# EAGLE design Min_Core_Display_v2 (EAGLE 9.3.0)
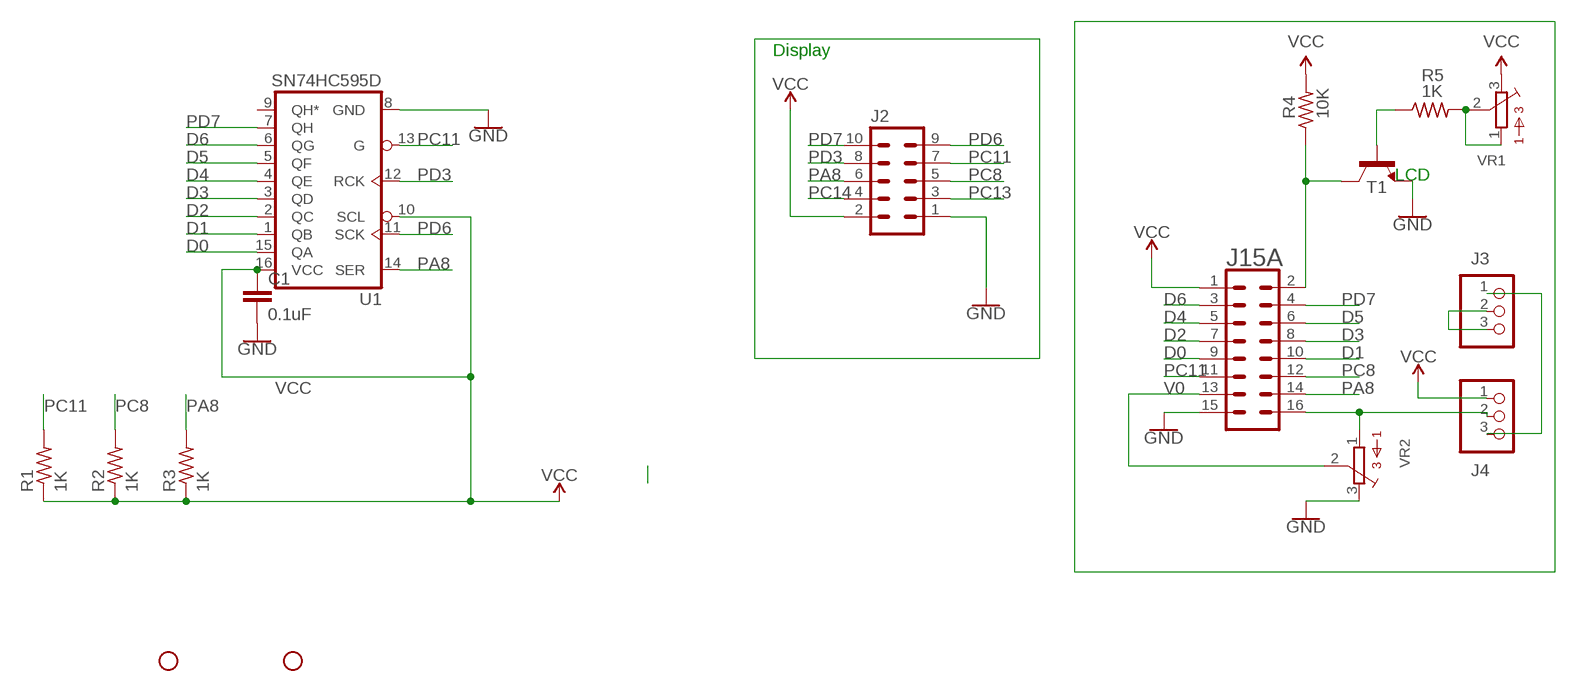
[diagram p0: schematic, sheet 1]

## Parts
C1  0.1uF  0.1UF-0603-25V-(+80/-20%)  [0603]
H2  STAND-OFFTIGHT  [STAND-OFF-TIGHT]
H4  STAND-OFFTIGHT  [STAND-OFF-TIGHT]
J2  10PIN_BACKSIDE  [10PIN_BACKSIDE]
J3  PINHD-1X3  [1X03]
J4  PINHD-1X3  [1X03]
J15A  CONN_08X2_SHROUD  [2X8-SHROUDED_LOCK]
R1  1K  R-US_R0603  [R0603]
R2  1K  R-US_R0603  [R0603]
R3  1K  R-US_R0603  [R0603]
R4  10K  R-US_R0603  [R0603]
R5  1K  R-US_R0603  [R0603]
T1  600mA/40V  TRANS_NPN-P2N2222A  [TO-92]
U1  SN74HC595D  74HC595D  [SO16]
VR1  BOURNS_3362P_TRIMMERP  [BOURNS_3362P_TRIMMER]
VR2  BOURNS_3362P_TRIMMERP  [BOURNS_3362P_TRIMMER]

## Nets
D0: J15A.9 U1.15(QA)
D1: J15A.10 U1.1(QB)
D2: J15A.7 U1.2(QC)
D3: J15A.8 U1.3(QD)
D4: J15A.5 U1.4(QE)
D5: J15A.6 U1.5(QF)
D6: J15A.3 U1.6(QG)
GND: C1.2 J2.1 J15A.15 T1.3(E) U1.8(GND) VR2.3
N$2: R5.1 T1.2(B)
N$3: J3.2 J3.3
N$5: R5.2 VR1.1 VR1.2
N$7: J15A.2 R4.1 T1.1(C)
N$9: J3.1 J4.3
N$10: J4.2 J15A.16 VR2.1
PA8: J2.6 J15A.14 R3.2 U1.14(SER)
PC8: J2.5 J15A.12 R2.2
PC11: J2.7 J15A.11 R1.2 U1.13(G)
PC13: J2.3
PC14: J2.4
PD3: J2.8 U1.12(RCK)
PD6: J2.9 U1.11(SCK)
PD7: J2.10 J15A.4 U1.7(QH)
V0: J15A.13 VR2.2
VCC: C1.1 J2.2 J4.1 J15A.1 R1.1 R2.1 R3.1 R4.2 U1.10(SCL) U1.16(VCC) VR1.3
Unconnected: U1.9(QH*)

## Notes on the sheet
- Display
- LCD

## Library data of the parts
C1 = SparkFun-Capacitors:0.1UF: 0.1µF ceramic capacitors A capacitor is a passive two-terminal electrical component used to store electrical energy temporarily in an electric field.; PROD_ID: CAP-00810
H2 H4 = SparkFun-Hardware:STAND-OFF: Stand Off Drill holes for mechanically mounting via screws, standoffs, etc. Note: Use the keepout ring to avoid running the screw head into surrounding components. Variant Overviews STAND-OFF - Mechanical footprint for a #4 phillips button head screw. STAND-OFF-TIGHT - Mechanical footprint for a #4 phillips button head screw, Example SparkFun Products Screw - Phillips Head (1/4", 4-40, 10 pack) <https://www.sparkfun.com/products/10453> (PRT-10453) Screw - Phillips Head (1/2", 4-40, 10 pack) <https://www.sparkfun.com/products/10452> (PRT-10452) Screw - Phillips Head (3/4", 4-40, 10 pack) <https://www.sparkfun.com/products/10451> (PRT-10451) Screw - Phillips Head (1", 4-40, 10 pack) <https://www.sparkfun.com/products/10450> (PRT-10450)
J2 = MusicThingModular:10PIN_BACKSIDE: PIN HEADER; OC_FARNELL: unknown; OC_NEWARK: unknown
J3 J4 = adafruit:PINHD-1X3: PIN HEADER
J15A = SparkFun-Connectors:CONN_08X2: Multi connection point. Often used as Generic Header-pin footprint for 0.1 inch spaced/style header connections You can populate with any combo of single row headers, but if you'd like an exact match, check this: Header - 2x8 (Male, 0.1") <https://www.sparkfun.com/products/13156> (PRT-13156) On any of the 0.1 inch spaced packages, you can populate with these: Break Away Headers - Straight <https://www.sparkfun.com/products/116> (PRT-00116) Break Away Male Headers - Right Angle <https://www.sparkfun.com/products/553> (PRT-00553) Female Headers <https://www.sparkfun.com/products/115> (PRT-00115) Break Away Headers - Machine Pin <https://www.sparkfun.com/products/117> (PRT-00117) Break Away Female Headers - Swiss Machine Pin <https://www.sparkfun.com/products/743> (PRT-00743)
R1-R5 = adafruit:R-US_: RESISTOR, American symbol
T1 = SparkFun-DiscreteSemi:TRANS_NPN: NPN transistor Current controlled devices typically used to amplify current or used as a switch. BC547 - COM-08928 <http://www.sparkfun.com/products/8928> (TO-92 45V 100mA) (1.Collector 2.Base 3.Emitter) 2N3904 - COM-00521 <http://www.sparkfun.com/products/521> (TO-92 40V 200mA) (1.Emitter 2.Base 3.Collector) P2N2222A - COM-12852 <http://www.sparkfun.com/products/12852> (TO-92 40V 600mA) (1.Collector 2.Base 3.Emitter); PROD_ID: TRANS-09536
U1 = SparkFun-IC-Logic:74*595: 8-Bit Shift Register (Serial to Parallel) Datasheet <http://cdn.sparkfun.com/datasheets/BreakoutBoards/MM74HC595.pdf> SparkFun Products SparkFun Shift Register Breakout - 74HC595 <https://www.sparkfun.com/products/10680> (BOB-10680); PROD_ID: IC-07875
VR1 VR2 = MusicThingModular:BOURNS_3362P_TRIMMER: 3362 Series 1/4" Square Trimmer

## Net classes
0 default: width 0.508 mm, drill 1.016 mm, clearance 0.508 mm

## Board
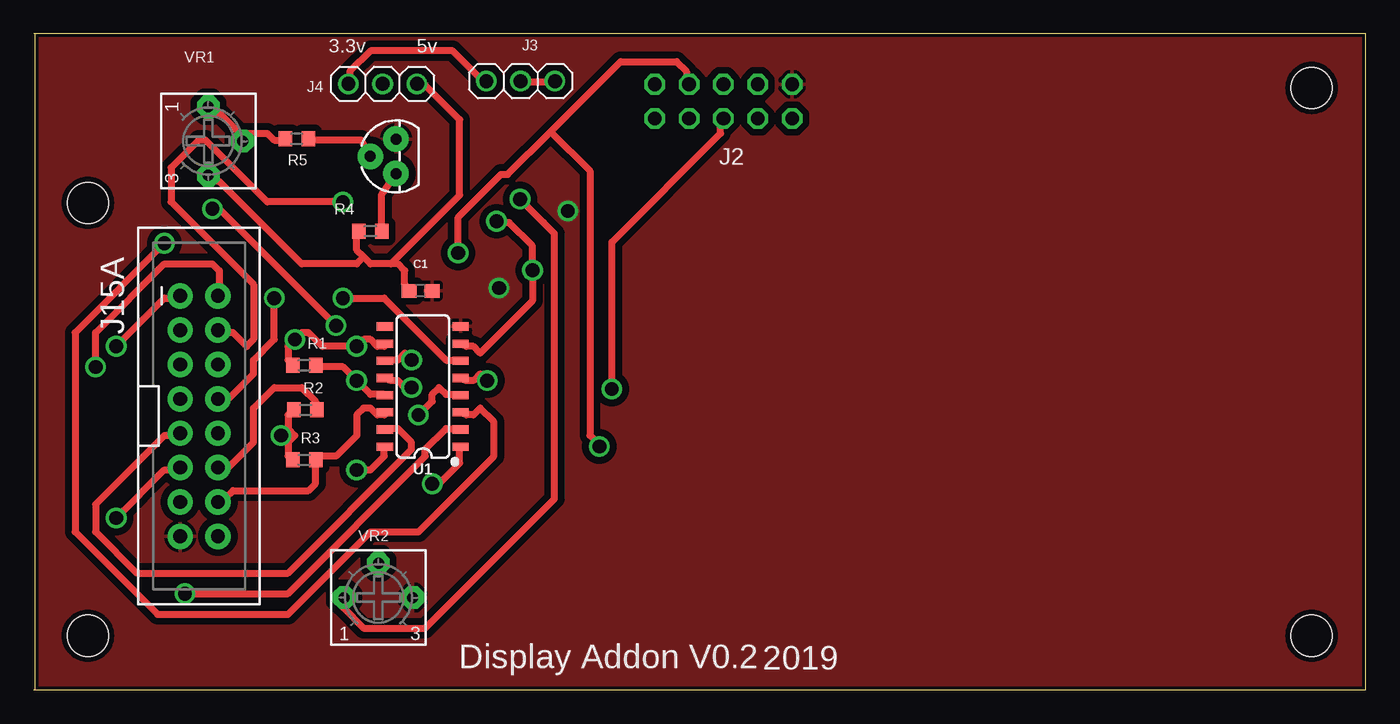
[diagram p1: board, top side]
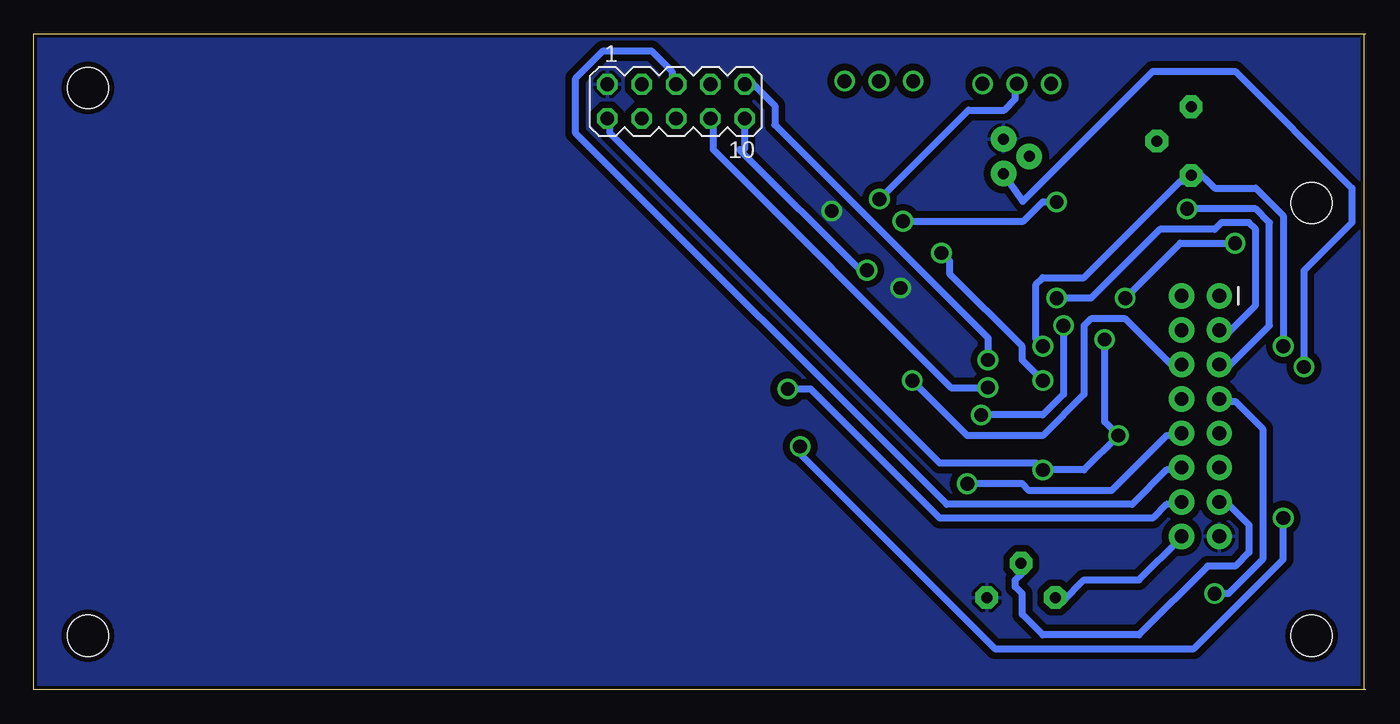
[diagram p2: board, bottom side, seen from below]

Size 98.5 x 48.5 mm. Coordinates in mm from the lower left corner, seen from the top.
Outline: 0,0 0.1,0
Outline: 0.1,0 98.5,0 98.5,48.5 0.1,48.5
Outline: 0.1,48.5 0,48.5
Outline: 0.1,0 0.1,48.5
Copper layers (1*16): Top 0.035mm / dielectric 1.5mm / Bottom 0.035mm
Design rules "dirt_cheap_dirty_boards.v1.1": minimum track width 6mil, minimum drill 12mil, track to track 6mil, track to pad 6mil, pad to pad 6mil, via to via 6mil, smd to smd 0mil, copper to edge 10mil, drill to drill 10mil, minimum pad ring 10mil, minimum via ring 6mil, stop-mask expansion 2mil, vias tented up to drill 25mil, thermal gap 10mil

### Footprints (pad centres in the part's own frame; a part is rotated, then mirrored left to right if it is on the bottom)
0603 = smd 1.1 x 1: 1 -0.85,0; 2 0.85,0
STAND-OFF-TIGHT = hole 3.048: 0,0
10PIN_BACKSIDE = drill 1.016 octagon: 1 -5.08,-1.27; 2 -5.08,1.27; 3 -2.54,-1.27; 4 -2.54,1.27; 5 0,-1.27; 6 0,1.27; 7 2.54,-1.27; 8 2.54,1.27; 9 5.08,-1.27; 10 5.08,1.27
1X03 = drill 1.016: 1 -2.54,0; 2 0,0; 3 2.54,0
2X8-SHROUDED_LOCK = drill 1.016 pad 1.88: 1 -1.397,8.89; 2 1.397,8.89; 3 -1.397,6.35; 4 1.397,6.35; 5 -1.397,3.81; 6 1.397,3.81; 7 -1.397,1.27; 8 1.397,1.27; 9 -1.397,-1.27; 10 1.397,-1.27; 11 -1.397,-3.81; 12 1.397,-3.81; 13 -1.397,-6.35; 14 1.397,-6.35; 15 -1.397,-8.89; 16 1.397,-8.89
R0603 = smd 1 x 1.1: 1 -0.85,0; 2 0.85,0
TO-92 = drill 0.813 pad 1.88: 1 -1.27,0; 2 0,1.905; 3 1.27,0
SO16 = smd 0.6 x 1.2: 1 -4.445,-2.8; 2 -3.175,-2.8; 3 -1.905,-2.8; 4 -0.635,-2.8; 5 0.635,-2.8; 6 1.905,-2.8; 7 3.175,-2.8; 8 4.445,-2.8; 9 4.445,2.8; 10 3.175,2.8; 11 1.905,2.8; 12 0.635,2.8; 13 -0.635,2.8; 14 -1.905,2.8; 15 -3.175,2.8; 16 -4.445,2.8
BOURNS_3362P_TRIMMER = drill 0.813 pad 1.676 octagon: 1 -2.54,0; 2 0,2.54; 3 2.54,0

### Placement (x,y rotation side)
C1  28.6,29.5 0 top
H1  STAND-OFFTIGHT  [STAND-OFF-TIGHT]  94.5,4 0 top
H2  4,36 0 top
H3  STAND-OFFTIGHT  [STAND-OFF-TIGHT]  94.5,44.5 90 top
H4  4,4 0 top
J2  51,43.5 180 top
J3  36,45 0 top
J4  25.8,44.8 180 top
J15A  12.22,20.24 0 top
R1  20,24 0 top
R2  20.1,20.7 0 top
R3  20,17 0 top
R4  24.89,33.91 180 top
R5  19.44,40.74 180 top
T1  26.79,39.44 90 top
U1  28.76,22.42 90 top
VR1  12.91,40.57 270 top
VR2  25.49,6.82 0 top

### Tracks (layer width: path | path; a pad name or v marks a point on that pad's centre or on a via)
D0
  Top 0.508: U1.15 26.42,19.3 26.92,19.3 27.94,18.29 27.94,17.78 18.8,8.64 7.62,8.64 4.57,11.68 4.57,13.72 9.65,18.8 10.67,18.8 J15A.9
D1  (via drill 1.02)
  Top 0.508: v29.46,15.24 29.97,15.24 31.5,16.76 31.5,17.78 U1.1
  Bottom 0.508: v29.46,15.24 25.4,15.24 24.89,14.73 18.8,14.73 14.73,18.8 13.72,18.8 J15A.10
D2  (via drill 1.02)
  Top 0.508: v11.18,7.11 18.8,7.11 28.96,17.27 28.96,17.78 30.48,19.3 31.5,19.3 U1.2
  Bottom 0.508: v11.18,7.11 10.16,7.11 7.62,9.65 7.62,19.3 9.65,21.34 10.67,21.34 J15A.7
D3  (via drill 1.02)
  Top 0.508: v9.65,33.02 3.05,26.42 3.05,11.68 9.14,5.59 18.8,5.59 24.89,11.68 28.45,11.68 34.04,17.27 34.04,19.81 33.02,20.83 32.51,20.32 32,20.32 U1.3 | v17.78,28.96 17.78,25.91 16.26,24.38 16.26,23.37 14.22,21.34 13.72,21.34 J15A.8
  Bottom 0.508: v9.65,33.02 13.72,33.02 v17.78,28.96
D4  (via drill 1.02)
  Top 0.508: v28.45,20.32 29.46,21.34 29.46,21.84 29.97,22.35 30.48,21.84 31.5,21.84 U1.4 | v22.35,26.92 13.72,35.56 v13.21,35.56
  Bottom 0.508: v28.45,20.32 23.88,20.32 22.35,21.84 v22.35,26.92 | v13.21,35.56 8.13,35.56 7.11,34.54 7.11,26.92 10.16,23.88 10.67,23.88 J15A.5
D5  (via drill 1.02)
  Top 0.508: v33.53,22.86 33.02,23.37 32.51,22.86 32,22.86 U1.5
  Bottom 0.508: v33.53,22.86 29.46,18.8 23.88,18.8 20.83,21.84 20.83,26.92 20.32,27.43 17.78,27.43 14.22,23.88 13.72,23.88 J15A.6
D6  (via drill 1.02)
  Top 0.508: v22.86,28.96 25.91,28.96 30.48,24.38 31.5,24.38 U1.6
  Bottom 0.508: v22.86,28.96 20.32,28.96 15.24,34.04 11.18,34.04 10.67,34.54 8.64,34.54 8.13,34.04 8.13,28.45 10.16,26.42 10.67,26.42 J15A.3
GND  (via drill 1.02)
  other vias: 39.5,35.4 34.4,29.7
  pour Top: -4,52 106,52 106,-2 -4,-2
  pour Bottom: -2,52 106,52 106,-4 -2,-4
N$2
  Top 0.508: R5.1 20.56,40.64 24.2,40.64 T1.2
N$3
  Top 0.508: J3.3 38.45,44.91 36.09,44.91 J3.2
N$5
  Top 0.508: 15.24,41.15 17.27,41.15 17.78,40.64 18.53,40.64 R5.2 | 15.24,41.15 15.24,40.64 VR1.2 15.24,41.15 | 15.24,41.15 13.72,42.67 13.21,42.67 VR1.1
N$7  (via drill 1.02)
  Top 0.508: T1.1 25.74,36.65 R4.1 | v4.57,23.88 4.57,26.42 9.65,31.5 13.21,31.5 13.72,30.99 13.72,29.46 J15A.2
  Bottom 0.508: v4.57,23.88 4.57,30.99 1.02,34.54 1.02,37.08 9.65,45.72 15.75,45.72 25.36,36.11 T1.1
N$9
  Top 0.508: J4.3 23.37,45.21 23.37,45.72 24.89,47.24 30.99,47.24 33.02,45.21 J3.1
N$10  (via drill 1.02)
  Top 0.508: v35.96,36.28 37.69,34.54 37.7,34.54 38.51,33.74 38.51,14.12 28.96,4.57 24.38,4.57 22.86,6.1 22.86,6.6 VR2.1
  Bottom 0.508: v35.96,36.28 29.37,42.86 26.73,42.86 25.91,43.69 25.91,44.7 J4.2 | J15A.16 13.72,11.18 16.76,8.13 20.83,8.13 22.35,6.6 22.86,6.6 VR2.1
PA8  (via drill 1.02)
  Top 0.508: U1.14 25.91,20.32 25.4,20.32 24.89,20.83 24.38,20.83 23.88,20.32 23.88,18.8 22.35,17.27 21.34,17.27 R3.2 20.83,16.76 20.83,15.24 20.32,14.73 14.73,14.73 14.22,14.22 14.22,13.72 13.72,13.72 J15A.14 | v42.75,22.24 42.75,33.1 50.8,41.15 50.8,42.16 J2.6
  Bottom 0.508: v42.75,22.24 41.03,22.24 31.5,12.7 15.75,12.7 14.73,13.72 13.72,13.72 J15A.14
PC8
  Top 0.508: R2.2 20.83,20.83 20.83,21.34 19.81,22.35 17.78,22.35 16.26,20.83 16.26,18.29 14.22,16.26 13.72,16.26 J15A.12
  Bottom 0.508: J2.5 51.31,45.21 51.31,45.72 52.83,47.24 56.39,47.24 58.42,45.21 58.42,41.15 30.99,13.72 17.27,13.72 14.73,16.26 13.72,16.26 J15A.12
PC11  (via drill 1.02)
  Top 0.508: R1.2 21.34,23.88 22.86,23.88 v23.88,22.86 24.89,21.84 25.91,21.84 U1.13 | 38.22,41.27 35.05,38.1 34.54,38.1 31.38,34.94 v31.38,32.3 | 38.22,41.27 43.4,46.44 47.54,46.44 48.26,45.72 48.26,45.21 J2.7 | v6.1,12.7 9.65,16.26 10.67,16.26 J15A.11 | v41.83,18 41.83,18.11 41.12,18.82 41.12,38.36 38.22,41.27
  Bottom 0.508: v31.38,32.3 30.78,31.7 30.78,30.78 25.4,25.4 25.4,24.38 v23.88,22.86 | v6.1,12.7 6.1,9.65 12.7,3.05 27.43,3.05 41.83,17.45 v41.83,18
PD3  (via drill 1.02)
  Top 0.508: v27.94,22.35 27.43,22.35 26.92,22.86 26.42,22.86 U1.12
  Bottom 0.508: v27.94,22.35 30.66,22.35 48.26,39.95 48.26,42.16 J2.8
PD6  (via drill 1.02)
  Top 0.508: v27.94,24.38 27.43,24.89 26.92,24.38 26.42,24.38 U1.11
  Bottom 0.508: v27.94,24.38 27.94,26.02 43.69,41.76 43.69,43.18 45.72,45.21 J2.9
PD7  (via drill 1.02)
  Top 0.508: U1.7 32,25.4 32.51,25.4 33.02,24.89 36.88,28.76 v36.88,31.02 36.88,32.82 35.16,34.54 34.33,34.54 v34.23,34.64 | v22.86,36.07 17.27,36.07 12.7,40.64 12.19,40.64 10.16,38.61 10.16,36.07 16.26,29.97 16.26,25.91 15.75,25.4 14.73,26.42 13.72,26.42 J15A.4
  Bottom 0.508: v36.88,31.02 37.38,31.02 46.3,39.94 45.92,40.02 J2.10 | v22.86,36.07 23.88,36.07 25.3,34.64 v34.23,34.64
V0
  Bottom 0.508: VR2.2 25.4,9.14 25.4,8.64 25.91,8.13 25.91,7.62 25.4,7.11 25.4,5.59 23.88,4.06 16.76,4.06 11.68,9.14 9.65,9.14 8.64,10.16 8.64,12.19 10.67,14.22 J15A.13
VCC  (via drill 1.02)
  Top 0.508: 24.38,32 24.89,31.5 26.42,31.5 | 24.38,32 23.88,32.51 23.88,33.53 R4.2 | 26.42,31.5 26.92,31.5 27.43,30.99 27.43,29.97 C1.1 | 26.42,31.5 31.5,36.58 31.5,42.16 28.96,44.7 28.45,44.7 J4.1 | 24.38,32 23.88,31.5 19.81,31.5 13.72,37.59 13.21,37.59 VR1.3 | v6.1,25.4 9.65,28.96 10.67,28.96 J15A.1 | R1.1 18.8,24.38 18.8,25.4 v19.3,25.91 19.81,26.42 20.32,26.42 21.34,25.4 v23.88,25.4 24.38,25.91 24.89,25.91 25.4,25.4 25.91,25.4 U1.10 | 18.8,19.3 19.3,18.8 18.8,18.29 18.8,17.27 R3.1 | 18.8,19.3 18.8,20.32 R2.1 | v23.88,16.26 24.89,16.26 25.91,17.27 25.91,17.78 U1.16 | 18.8,19.3 v18.29,18.8
  Bottom 0.508: v6.1,25.4 6.1,35.05 8.13,37.08 11.18,37.08 12.7,38.61 13.21,38.1 VR1.3 13.21,37.59 13.72,37.59 20.83,30.48 23.88,30.48 24.38,29.97 24.38,25.91 v23.88,25.4 | J2.2 55.88,42.16 55.88,41.15 31.5,16.76 24.38,16.76 v23.88,16.26 20.83,16.26 v18.29,18.8 19.3,19.81 v19.3,25.91

### Text on the board
tPlace: 3.3v | 5v | J15A | Display Addon V0.2 | 2019